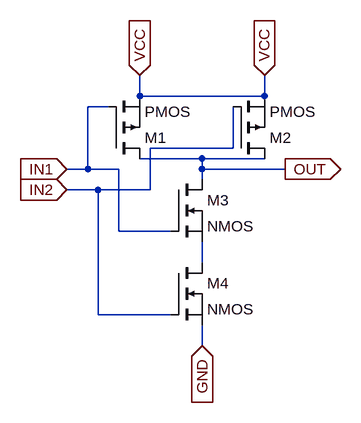
[diagram p0: schematic nand.asc]
nand.asc, the LTspice schematic file:
Version 4.1
SHEET 1 880 680
WIRE 80 48 80 16
WIRE 272 48 272 16
WIRE 272 48 80 48
WIRE 32 64 0 64
WIRE 224 128 224 64
WIRE 224 128 96 128
WIRE 176 144 80 144
WIRE 272 144 176 144
WIRE 0 160 0 64
WIRE 0 160 -32 160
WIRE 48 160 0 160
WIRE 176 160 176 144
WIRE 304 160 176 160
WIRE 176 176 176 160
WIRE 16 192 -32 192
WIRE 96 192 96 128
WIRE 96 192 16 192
WIRE 48 256 48 160
WIRE 128 256 48 256
WIRE 176 304 176 272
WIRE 16 384 16 192
WIRE 128 384 16 384
WIRE 176 432 176 400
FLAG -32 160 IN1
IOPIN -32 160 In
FLAG 80 16 VCC
IOPIN 80 16 In
FLAG 272 16 VCC
IOPIN 272 16 In
FLAG 304 160 OUT
IOPIN 304 160 Out
FLAG -32 192 IN2
IOPIN -32 192 In
FLAG 176 432 GND
IOPIN 176 432 In
SYMBOL pmos 32 144 M180
SYMATTR InstName M1
SYMBOL nmos 128 176 R0
SYMATTR InstName M3
SYMBOL pmos 224 144 M180
SYMATTR InstName M2
SYMBOL nmos 128 304 R0
SYMATTR InstName M4

The netlist it stands for:
* nand.asc
M1 OUT IN1 VCC VCC PMOS
M3 OUT IN1 N001 N001 NMOS
M2 OUT IN2 VCC VCC PMOS
M4 N001 IN2 GND GND NMOS
.model NMOS NMOS
.model PMOS PMOS
.lib standard.mos
.backanno
.end